# EAGLE design HV power supply (EAGLE 5.11)
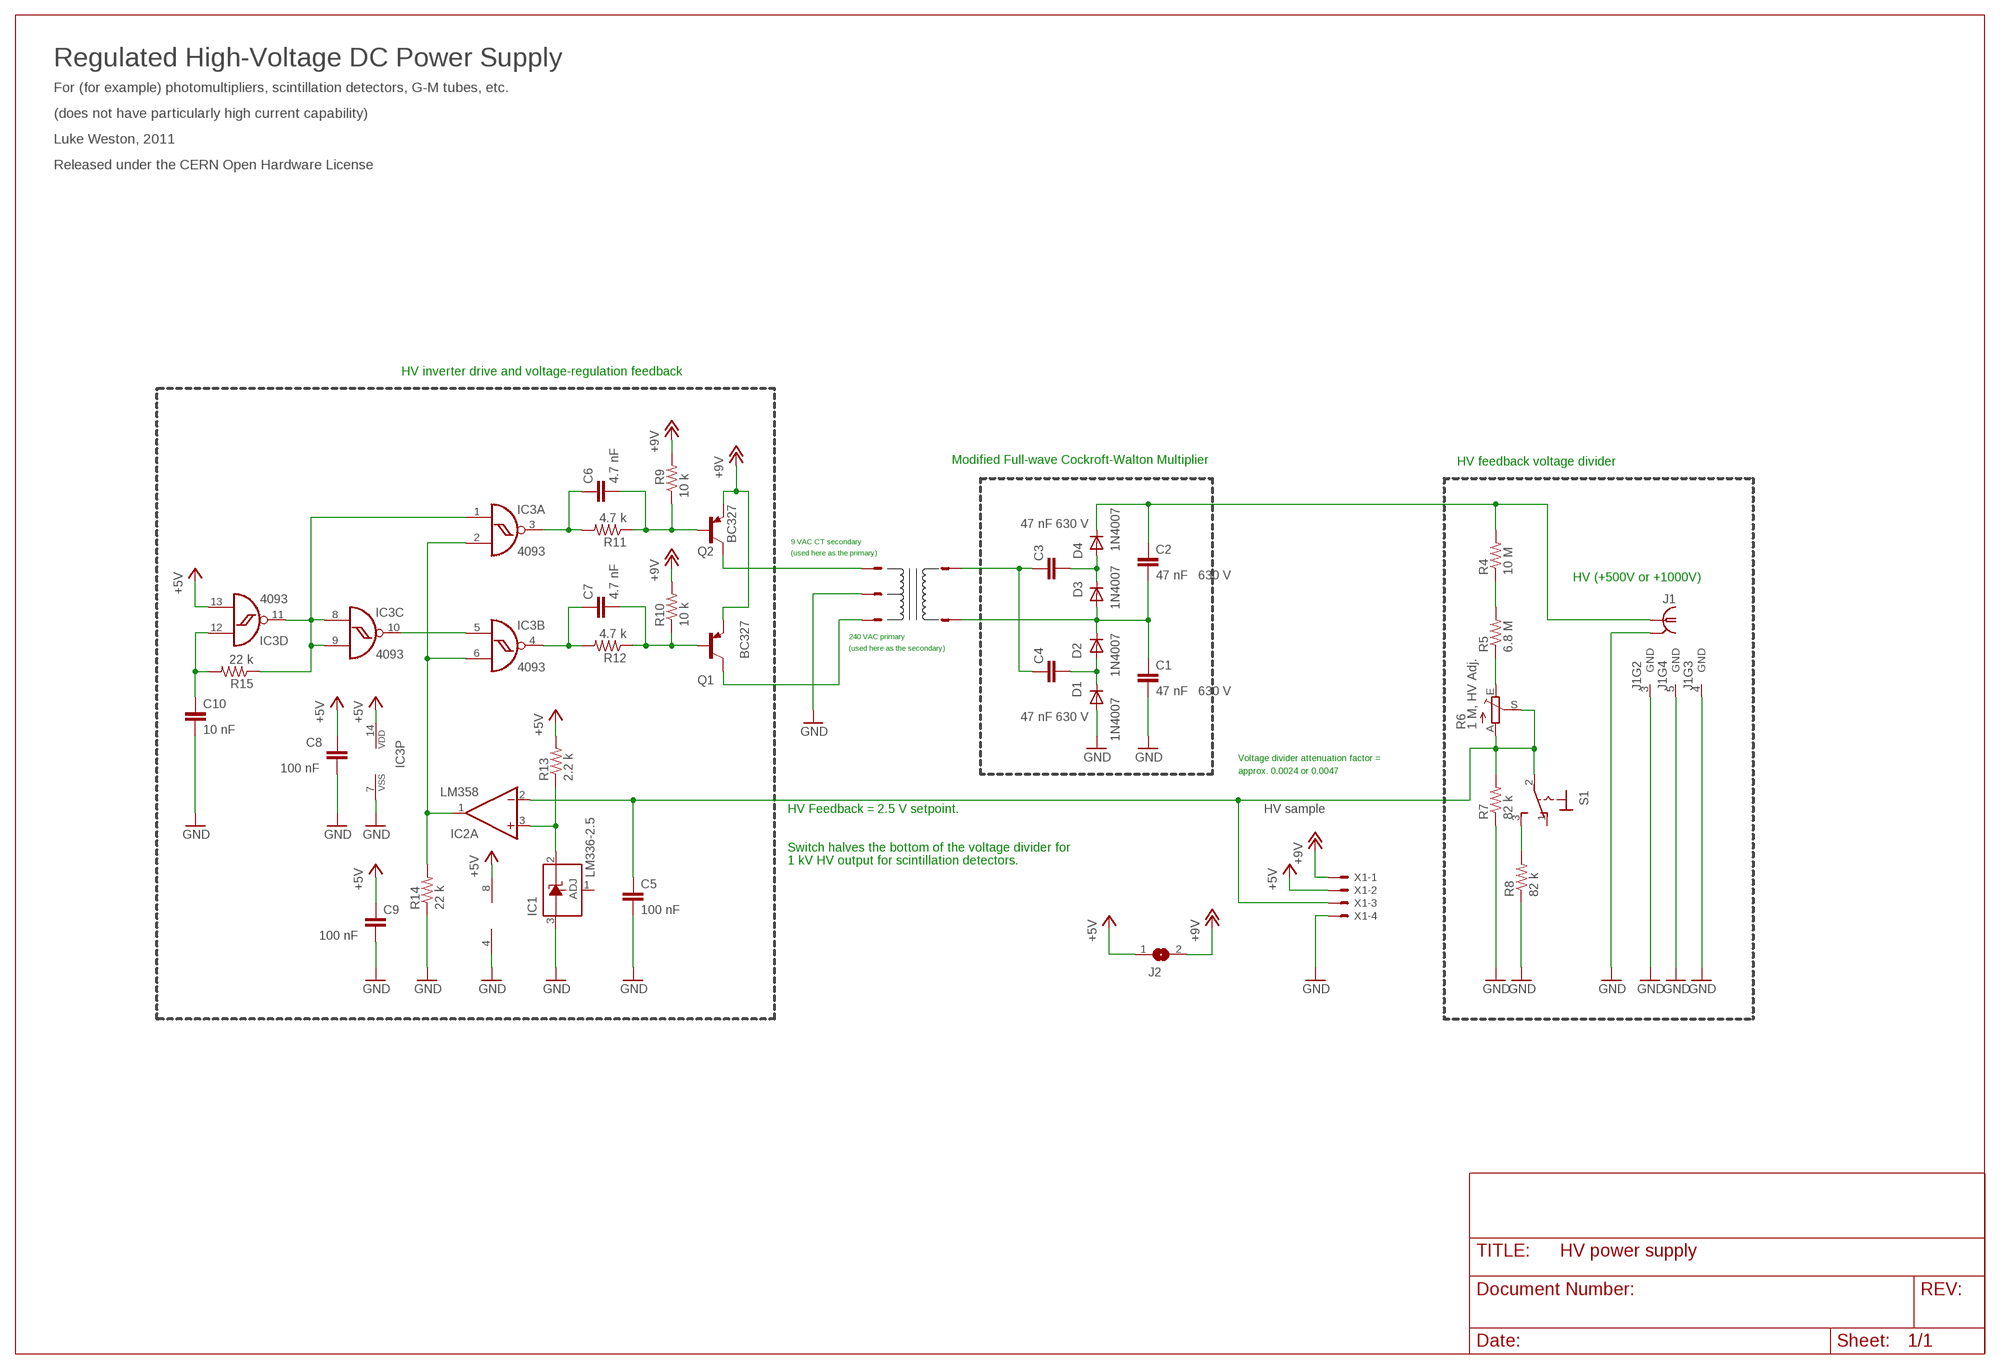
[diagram p0: schematic, sheet 1]

## Parts
C1  47 nF 630 V  C-EU150-072X183  [C150-072X183]
C2  47 nF 630 V  C-EU150-072X183  [C150-072X183]
C3  47 nF 630 V  C-EU150-072X183  [C150-072X183]
C4  47 nF 630 V  C-EU150-072X183  [C150-072X183]
C5  100 nF  C-EU050-025X075  [C050-025X075]
C6  4.7 nF  C-EU050-025X075  [C050-025X075]
C7  4.7 nF  C-EU050-025X075  [C050-025X075]
C8  100 nF  C-EU050-025X075  [C050-025X075]
C9  100 nF  C-EU050-025X075  [C050-025X075]
C10  10 nF  C-EU050-025X075  [C050-025X075]
D1  1N4007  1N4004  [DO41-10]
D2  1N4007  1N4004  [DO41-10]
D3  1N4007  1N4004  [DO41-10]
D4  1N4007  1N4004  [DO41-10]
IC1  LM336-2.5  LM336LP  [TO92]
IC2  LM358  LM358N  [DIL08]
IC3  4093  4093N  [DIL14]
J1  BN35N61  [B35N61]
J2  SJ  [SJ]
Q1  BC327  [TO92]
Q2  BC327  [TO92]
R4  10 M  R-US_0207/10  [0207/10]
R5  6.8 M  R-US_0207/10  [0207/10]
R6  1 M, HV Adj.  TRIM_EU-S64W  [S64W]
R7  82 k  R-US_0207/10  [0207/10]
R8  82 k  R-US_0207/10  [0207/10]
R9  10 k  R-US_0207/10  [0207/10]
R10  10 k  R-US_0207/10  [0207/10]
R11  4.7 k  R-US_0207/10  [0207/10]
R12  4.7 k  R-US_0207/10  [0207/10]
R13  2.2 k  R-US_0207/10  [0207/10]
R14  22 k  R-US_0207/10  [0207/10]
R15  22 k  R-US_0207/10  [0207/10]
S1  320-916  [320-916]
X1  22-23-2041  [22-23-2041]
X2  22-23-2031  [22-23-2031]
X3  22-23-2021  [22-23-2021]

## Nets
+5V: C8.1 C9.1 IC2.8(P:V+) IC3.13(D:I1) IC3.14(P:VDD) J2.1 R13.2 X1.2
+12V: J2.2 Q1.1(E) Q2.1(E) R9.2 R10.2 X1.1 ; supply symbol labelled +9V
GND: C1.2 C5.2 C8.2 C9.2 C10.2 D1.A IC1.3(A) IC2.4(P:V-) IC3.7(P:VSS) J1.2(GND) J1.3(GND) J1.4(GND) J1.5(GND) R7.1 R8.1 R14.1 X1.4 X2.2
N$5: R4.1 R5.2
N$7: Q1.3(C) X2.1
N$8: C6.2 Q2.2(B) R9.1 R11.1
N$9: C1.1 C2.2 D2.C D3.A X3.2
N$10: Q2.3(C) X2.3
N$11: C4.2 D1.C D2.A
N$12: C3.2 D3.C D4.A
N$13: C2.1 D4.C J1.1 R4.2
N$14: C5.1 IC2.2(A:-IN) R6.A R6.S R7.2 S1.2(P) X1.3
N$15: C3.1 C4.1 X3.1
N$16: R5.1 R6.E
N$17: R8.2 S1.3(S)
N$18: C7.2 Q1.2(B) R10.1 R12.1
N$19: IC1.2(C) IC2.3(A:+IN) R13.1
N$20: C7.1 IC3.4(B:O) R12.2
N$21: C6.1 IC3.3(A:O) R11.2
N$22: IC2.1(A:OUT) IC3.2(A:I1) IC3.6(B:I1) R14.2
N$23: IC3.5(B:I0) IC3.10(C:O)
N$25: IC3.1(A:I0) IC3.8(C:I0) IC3.9(C:I1) IC3.11(D:O) R15.1
N$26: C10.1 IC3.12(D:I0) R15.2
Unconnected: IC1.1(ADJ) IC2.5(B:+IN) IC2.6(B:-IN) IC2.7(B:OUT) S1.1(O)

## Notes on the sheet
- Regulated High-Voltage DC Power Supply
- For (for example) photomultipliers, scintillation detectors, G-M tubes, etc.
- (does not have particularly high current capability)
- Luke Weston, 2011
- Released under the CERN Open Hardware License
- HV inverter drive and voltage-regulation feedback
- Modified Full-wave Cockroft-Walton Multiplier | HV feedback voltage divider
- 9 VAC CT secondary
- (used here as the primary)
- HV (+500V or +1000V)
- 240 VAC primary
- (used here as the secondary)
- Voltage divider attenuation factor =
- approx. 0.0024 or 0.0047
- HV Feedback = 2.5 V setpoint. | HV sample
- Switch halves the bottom of the voltage divider for
- 1 kV HV output for scintillation detectors.

## Library data of the parts
C1-C10 = rcl:C-EU: CAPACITOR, European symbol
D1-D4 = adafruit:1N4004: DIODE General purpose 1N400x type rectifier (With bigger pads) http://www.ladyada.net/library/pcb/eaglelibrary.html
IC1 = linear:LM336: 2.5-V INTEGRATED REFERENCE CIRCUITS LM236 Source: http://focus.ti.com/lit/ds/symlink/lm336-2.5.pdf
IC2 = linear:LM358: OP AMP also LM158; LM258; LM2904 Source: http://cache.national.com/ds/LM/LM158.pdf
IC3 = 40xx:4093: Quad 2-input NAND schmitt trigger
J1 = con-coax:BN35N61: BNC CONNECTOR M/A COM www.macom.com distributor Farnell 149-452; OC_FARNELL: unknown; OC_NEWARK: unknown
J2 = jumper:SJ: SMD solder JUMPER
Q1 Q2 = transistor-pnp:BC327: PNP Transistor
R4 R5 R7-R15 = rcl:R-US_: RESISTOR, American symbol
R6 = pot:TRIM_EU-: POTENTIOMETER
S1 = switch:320-916: TOGGLE SWITCH distributor RS Components
X1 = con-molex:22-23-2041: .100" (2.54mm) Center Header - 4 Pin; MF: MOLEX; MPN: 22-23-2041; OC_FARNELL: 1462920; OC_NEWARK: 38C0355
X2 = con-molex:22-23-2031: .100" (2.54mm) Center Header - 3 Pin; MF: MOLEX; MPN: 22-23-2031; OC_FARNELL: 1462950; OC_NEWARK: 30C0862
X3 = con-molex:22-23-2021: .100" (2.54mm) Center Header - 2 Pin; MF: MOLEX; MPN: 22-23-2021; OC_FARNELL: 1462926; OC_NEWARK: 25C3832

## Board
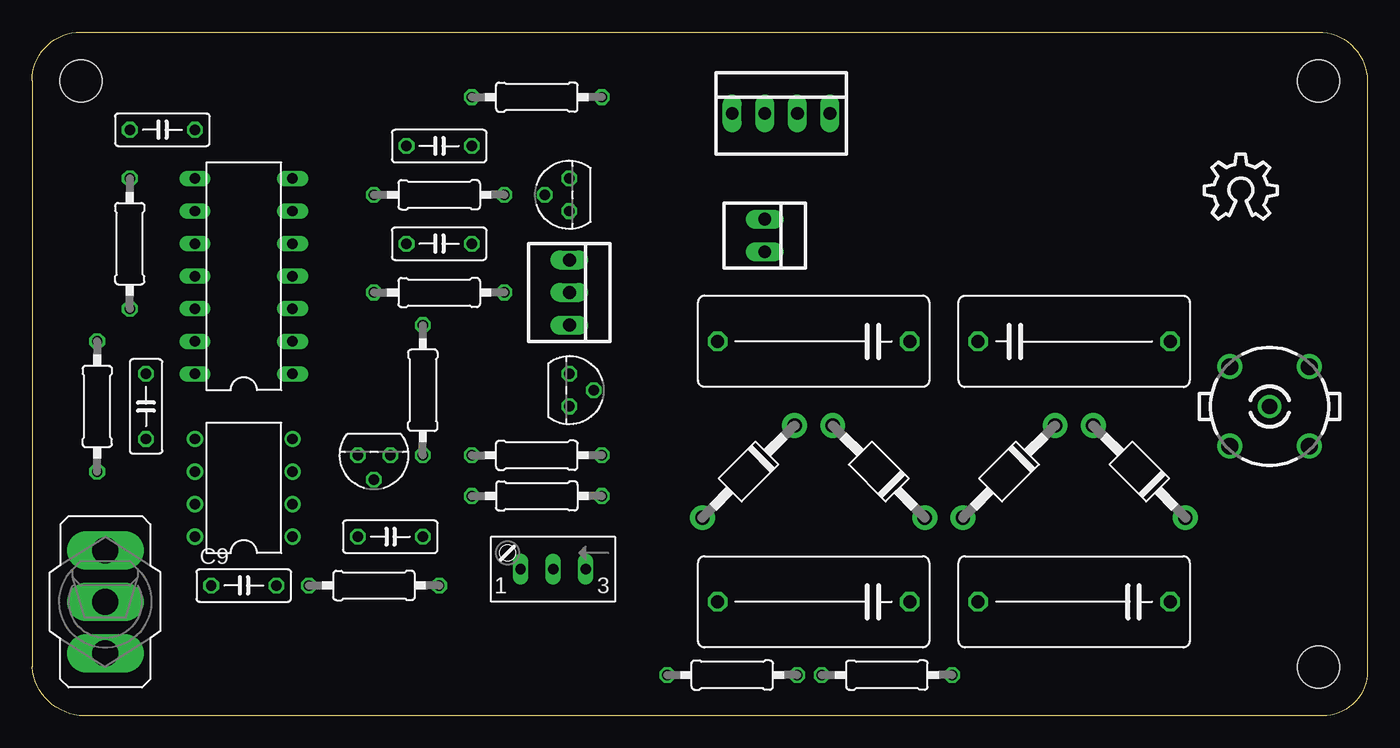
[diagram p1: board, top side]
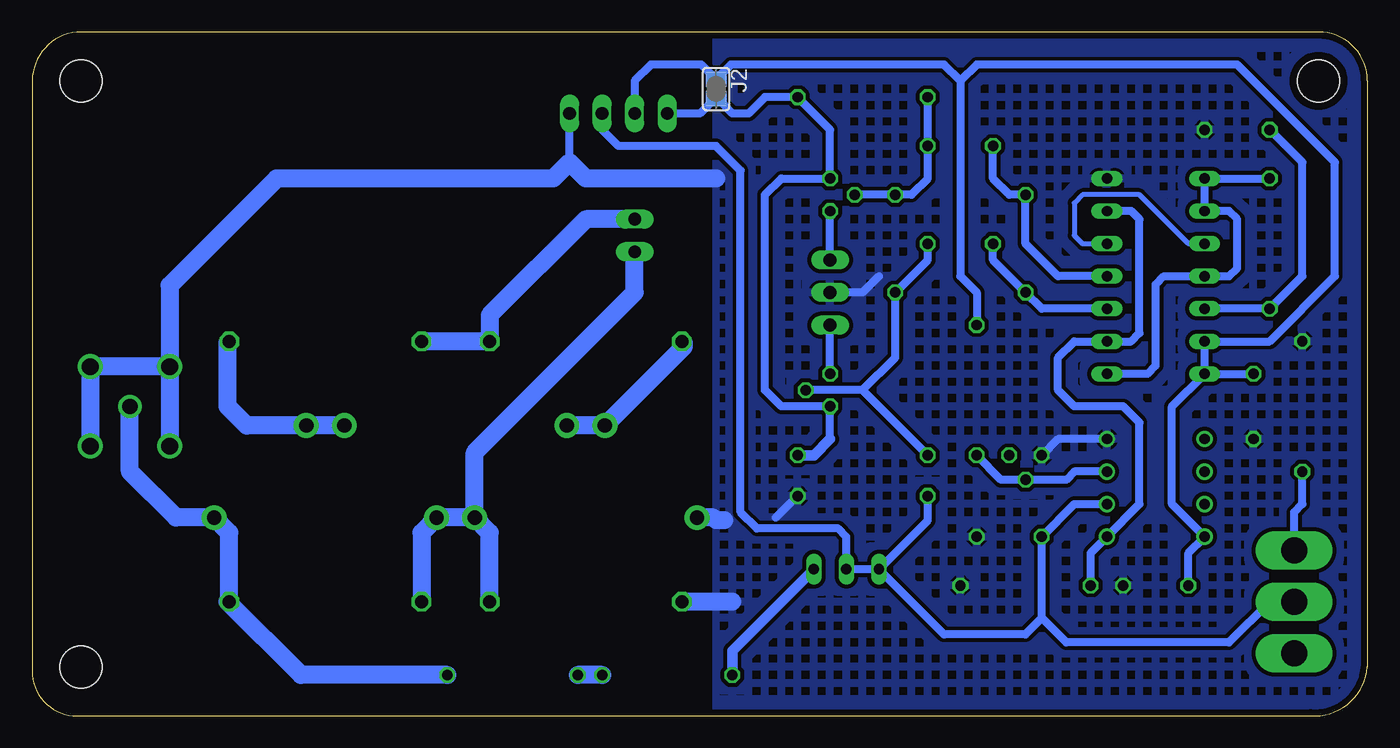
[diagram p2: board, bottom side, seen from below]

Size 104.15 x 53.35 mm. Coordinates in mm from the lower left corner, seen from the top.
Outline: 0,49.54 0,3.82 arc90 4.45,0.01 100.97,0.01 arc90 104.14,3.82 104.14,49.54 arc90 100.33,53.35 3.81,53.35 arc90 0,49.54
Copper layers (1*16): Top 0.035mm / dielectric 1.5mm / Bottom 0.035mm
Design rules "PCBCart-Standard": minimum track width 8mil, minimum drill 0.4mm, track to track 8mil, track to pad 8mil, pad to pad 8mil, via to via 8mil, smd to smd 8mil, copper to edge 20mil, drill to drill 8mil, minimum pad ring 8mil, minimum via ring 10mil, stop-mask expansion 3mil, vias tented up to drill 0mil, thermal gap 8mil

### Footprints (pad centres in the part's own frame; a part is rotated, then mirrored left to right if it is on the bottom)
C150-072X183 = drill 1.016 octagon: 1 -7.493,0; 2 7.493,0
C050-025X075 = drill 0.813 octagon: 1 -2.54,0; 2 2.54,0
DO41-10 = drill 1.118 pad 1.93 round: A 5.08,0; C -5.08,0
TO92 = drill 0.813 octagon: 1 -1.27,0; 2 0,1.905; 3 1.27,0
DIL08 = drill 0.813 pad 1.27 round: 1 -3.81,-3.81; 2 -1.27,-3.81; 3 1.27,-3.81; 4 3.81,-3.81; 5 3.81,3.81; 6 1.27,3.81; 7 -1.27,3.81; 8 -3.81,3.81
DIL14 = drill 0.813 long: 1 -7.62,-3.81; 2 -5.08,-3.81; 3 -2.54,-3.81; 4 0,-3.81; 5 2.54,-3.81; 6 5.08,-3.81; 7 7.62,-3.81; 8 7.62,3.81; 9 5.08,3.81; 10 2.54,3.81; 11 0,3.81; 12 -2.54,3.81; 13 -5.08,3.81; 14 -7.62,3.81
B35N61 = drill 1.2 round: 1 0,0 | drill 1.3 round: 2 3.099,3.099; 3 -3.099,3.099; 4 -3.099,-3.099; 5 3.099,-3.099
SJ = smd 1.168 x 1.6: 1 -0.762,0; 2 0.762,0
TO92' = drill 0.813 octagon: 1 1.27,0; 2 0,1.905; 3 -1.27,0
0207/10 = drill 0.813 octagon: 1 -5.08,0; 2 5.08,0
S64W = drill 0.813 long: A 2.54,1.27; E -2.54,1.27; S 0,1.27
320-916 = drill 2.007 long: 1 0,4.013; 2 0,0; 3 0,-4.013
STAND-OFF = hole 3.302: 0,0
22-23-2041 = drill 1 long: 1 -3.81,0; 2 -1.27,0; 3 1.27,0; 4 3.81,0
22-23-2031 = drill 1 long: 1 -2.54,0; 2 0,0; 3 2.54,0
22-23-2021 = drill 1 long: 1 -1.27,0; 2 1.27,0

### Placement (x,y rotation side)
C1  60.96,8.9 180 top
C2  81.28,8.9 180 top
C3  81.28,29.22 0 top
C4  60.96,29.22 180 top
C5  27.94,13.98 0 top
C6  31.75,36.84 0 top
C7  31.75,44.46 0 top
C8  8.89,24.14 270 top
C9  16.51,10.17 0 top
C10  10.16,45.73 0 top
D1  55.88,19.06 225 top
D2  66.04,19.06 135 top
D3  76.2,19.06 225 top
D4  86.36,19.06 135 top
IC1  26.67,20.33 180 top
IC2  16.51,17.79 90 top
IC3  16.51,34.3 90 top
J1  96.52,24.14 0 top
J2  50.8,48.91 270 bottom
Q1  BC327  [TO92']  41.91,40.65 90 top
Q2  BC327  [TO92']  41.91,25.41 270 top
R4  66.67,3.19 0 top
R5  54.61,3.19 0 top
R6  40.64,12.71 180 top
R7  39.37,17.16 180 top
R8  5.08,24.14 270 top
R9  39.37,20.33 0 top
R10  39.37,48.27 0 top
R11  31.75,33.03 180 top
R12  31.75,40.65 180 top
R13  30.48,25.41 90 top
R14  26.67,10.17 180 top
R15  7.62,36.84 270 top
S1  5.71,8.9 180 top
U$1  [STAND-OFF]  3.81,49.54 0 top
U$2  [STAND-OFF]  100.33,3.82 0 top
U$3  [STAND-OFF]  100.33,49.54 0 top
U$4  [OSHW_10X200_NOTEXT]  91.44,38.75 0 top
X1  58.42,47 0 top
X2  41.91,33.03 270 top
X3  57.15,37.48 270 top

### Tracks (layer width: path | path; a pad name or v marks a point on that pad's centre or on a via)
+5V
  Bottom 0.61: IC3.14 IC3.13 7.62,29.22 2.54,34.3 2.54,43.19 10.16,50.81 30.48,50.81 31.75,49.54 | IC3.14 15.24,24.14 15.24,16.52 IC2.8 13.97,12.71 C9.1 | IC3.14 C8.1 | R13.2 30.48,33.03 31.75,34.3 31.75,49.54 | 31.75,49.54 33.02,50.81 49.66,50.81 J2.1 51.94,50.81 55.88,50.81 57.15,49.54 X1.2
+12V
  Bottom 0.61: 41.91,21.6 Q2.1 45.72,24.14 46.99,25.41 46.99,40.65 45.72,41.92 Q1.1 41.91,45.73 R10.2 46.99,48.27 48.26,47 49.53,47 50.67,48.14 | 50.67,48.14 J2.2 | 50.67,48.14 50.8,48.27 52.07,47 X1.1
  Bottom 0.813: R9.2 43.18,20.33 41.91,21.6
GND
  Bottom 0.61: X2.2 39.37,33.03 38.1,34.3 | IC2.4 24.13,21.6 IC1.3 | R7.1 46.14,15.47 | 62.23,43.19 X1.4
  Bottom 1.422: D1.A 51.02,15.47 50.8,15.25 50.16,15.25 | 49.53,8.9 C1.2 | 50.8,41.92 60.96,41.92 62.23,43.19 63.5,41.92 85.09,41.92 93.42,33.59 J1.3 | J1.3 J1.4 | J1.3 J1.2 J1.5
  pour Bottom (isolate 0.305, hatched): -1.27,54.62 50.8,54.62 50.8,-1.26 -1.27,-1.26
N$5
  Bottom 1.422: R5.2 R4.1
N$7
  Bottom 0.61: X2.1 Q1.3
N$8
  Bottom 0.61: 39.37,25.41 Q2.2 | R9.1 39.37,25.41 | 39.37,25.41 36.83,27.95 R11.1 34.29,35.57 C6.2
N$9
  Bottom 0.61: D3.A 72.61,15.67
  Bottom 1.422: C1.1 68.45,14.29 D2.C | C2.2 73.79,14.29 D3.A D2.C | D2.C 69.63,20.55 57.15,33.03 X3.2
N$10
  Bottom 0.61: Q2.3 X2.3
N$11
  Bottom 1.422: D2.A D1.C 53.34,28.79 53.34,29.09 C4.2
N$12
  Bottom 1.422: C3.2 88.9,29.09 88.9,24.14 87.41,22.65 D4.A D3.C
N$13
  Bottom 1.422: R4.2 83.19,3.19 88.9,8.9 C2.1 88.77,14.29 D4.C 92.93,15.47 96.52,19.06 J1.1
N$14
  Bottom 0.61: IC2.2 22.86,16.52 C5.1 25.4,7.63 | 25.4,7.63 23.49,5.73 10.79,5.73 7.62,8.9 S1.2 | 25.4,7.63 26.67,6.36 33.02,6.36 R6.A | R7.2 34.29,15.25 R6.A | R6.A R6.S 40.64,13.98 41.27,14.62 47.62,14.62 48.89,15.89 48.89,42.56 50.8,44.46 58.42,44.46 59.69,45.73 X1.3
N$15
  Bottom 1.422: C3.1 C4.1 68.45,31.25 60.96,38.75 X3.1
N$16
  Bottom 0.813: R5.1 49.53,5.09 R6.E
N$17
  Bottom 0.61: S1.3 5.71,15.89 5.08,16.52 R8.2
N$18
  Bottom 0.61: Q1.2 R12.1 35.56,40.65 34.29,41.92 C7.2 R10.1
N$19
  Bottom 0.61: IC2.3 22.86,19.06 23.49,18.43 IC1.2 28.58,18.43 R13.1
N$20
  Bottom 0.61: C7.1 29.21,41.92 27.94,40.65 R12.2 26.67,36.84 24.13,34.3 IC3.4
N$21
  Bottom 0.61: C6.1 29.21,35.57 R11.2 25.4,31.76 IC3.3
N$22
  Bottom 0.61: IC3.6 18.41,39.38 17.78,38.75 17.78,29.86 18.41,29.22 IC3.2 22.86,29.22 24.13,27.95 24.13,25.41 22.86,24.14 19.05,24.14 17.78,22.87 17.78,16.52 IC2.1 21.59,12.71 R14.2
N$23
  Bottom 0.406: IC3.10 13.97,36.84 17.78,40.65 22.23,40.65 22.86,40.02 22.86,37.48 22.23,36.84 IC3.5
N$25
  Bottom 0.61: IC3.1 17.14,26.68 16.51,27.32 16.51,33.67 15.88,34.3 IC3.11 10.79,34.3 10.16,34.94 10.16,38.75 10.79,39.38 IC3.9 IC3.8 R15.1
N$26
  Bottom 0.61: IC3.12 R15.2 5.08,34.3 5.08,43.19 C10.1

### Text on the board
Document: +6V | +5V | HV | GND | 240VAC PRIMARY | 9VAC SECONDARY | Switch open for 50% output voltage; closed for 100% | eg. switch from 1 kV scintillation detector to 500V GM.
Reference: High-voltage regulated DC supply | for G-M tubes, photomultipliers, etc. | Try not to take the output much above 1.2 kV. | Released under the CERN Open Hardware License | github.com/lukeweston/HVPS | Luke Weston, 2011 | OUTPUT